# Altium schematic sheet rs485.SchDoc: Test
size A4; DrawnBy: Łukasz Przeniosło; Organization: Zachodniopomorski; Address1: Uniwersytet Technologiczny; Address2: w Szczecinie; Address3: Wydział Elektryczny; DocumentNumber: 6; Revision: 1.0; SheetNumber: 6; SheetTotal: 8
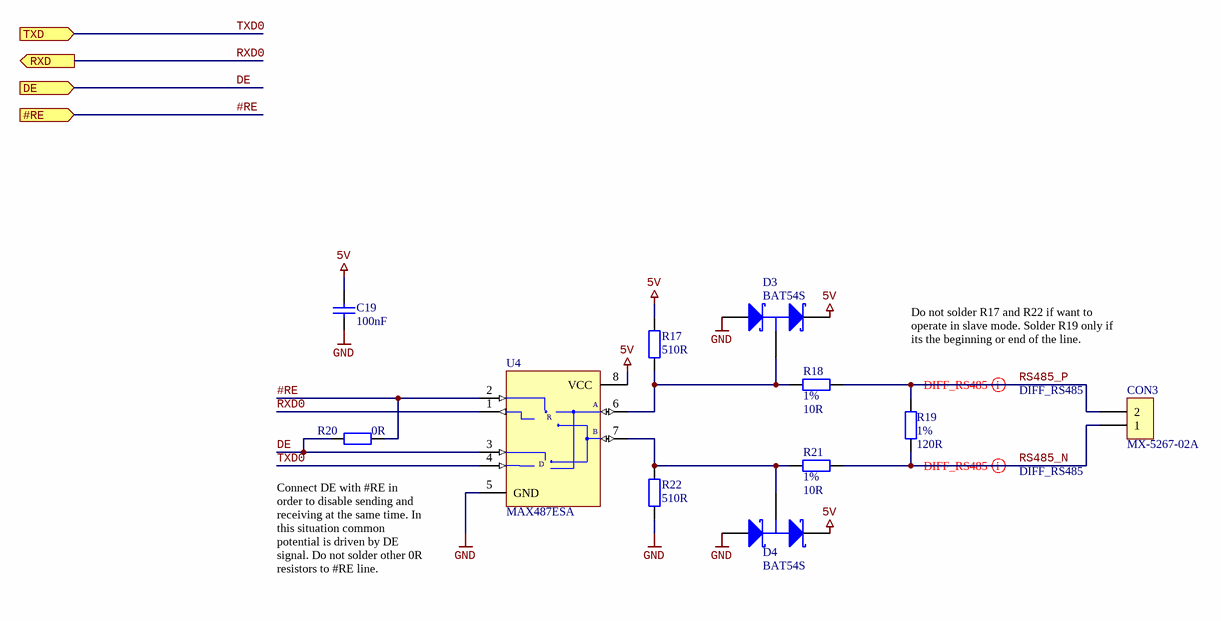
[diagram p0: rs485.SchDoc]

## Parts
C19  100nF  [CAPC1608N]
CON3  MX-5267-02A  [MX-5267-02A]
D3  BAT54S  [SOT23-3L]
D4  BAT54S  [SOT23-3L]
R17  510R  [RESC1608N]
R18  Tolerance: 1%  [RESC2012N]  (hidden comment: 10R)
R19  Tolerance: 1%  [RESC3216N]  (hidden comment: 120R)
R20  0R  [RESC1005N]
R21  Tolerance: 1%  [RESC2012N]  (hidden comment: 10R)
R22  510R  [RESC1608N]
U4  MAX487ESA  [SO-8_L]

## Ports
#RE (in), DE (in), RXD (out), TXD (in)

## Nets
5V: C19.1 D3.2(K) D4.2(K) R17.2 U4.8(VCC)
GND: C19.2 D3.1(A) D4.1(A) R22.1 U4.5(GND)
#RE: R20.2 U4.2(~{RE}) ; port #RE
DE: R20.1 U4.3(DE) ; port DE
RS485_N: CON3.1 R19.2 R21.1
RS485_P: CON3.2 R18.1 R19.1
RXD0: U4.1(RO) ; port RXD
TXD0: U4.4(DI) ; port TXD
NetD3_3: D3.3(C) R17.1 R18.2 U4.6(A)
NetD4_3: D4.3(C) R21.2 R22.2 U4.7(B)

## Layout directives
differential pair; net class DIFF_RS485: RS485_N, RS485_P

## Notes on the sheet
- Do not solder R17 and R22 if want to operate in slave mode. Solder R19 only if its the beginning or end of the line.
- (near R20) Connect DE with #RE in order to disable sending and receiving at the same time. In this situation common potential is driven by DE signal. Do not solder other 0R resistors to #RE line.
- Title
- Size:
- Date:
- A4
- Author:
- Time:
- Sheet
- of
- File:
- (in symbol MAX487ESA) R; D

## Library data of the parts
C19 = Capacitor: Value: 100nF
CON3 = MX-02227-2021: Pith 2.54mm, 2-pin; ComponentLink1Description: Manufacturer Link; ComponentLink2Description: Datasheet; Distributor: tme.pl; tme.pl: MX-6410-03A
D3 D4 = BAT54S: Schottky Barrier Double Diode; Published: 17-Sep-2003; DatasheetVersion: 4-Mar-2002; PackageVersion: May-1999; PackageReference: SOT23; Publisher: Altium Limited; PackageDescription: 3-Pin SOT-23 Package 0.95 mm Pitch, 2.3 mm Lead Span; ComponentLink1Description: Manufacturer Link; ComponentLink1URL: http://www.semiconductors.philips.com/; ComponentLink2Description: Datasheet; ComponentLink2URL: http://www.semiconductors.philips.com/acrobat/datasheets/BAT54_SERIES_4.pdf; LatestRevisionDate: 12-Dec-2006; LatestRevisionNote: IPC-7351 Footprint Added.
R17 R22 = Resistor: Tolerance: 5%; Power: 0W; Value: 510R
R18 R19 R21 = Resistor: Power: 0W
  R18 R21: Value: 10R
  R19: Value: 120R
R20 = Resistor: Power: 0W; Tolerance: 1%; Value: 0R
U4 = MAX487ESA: Low-Power, Slew-Rate-Limited RS-485/RS-422 Transceiver; Published: 16-Jan-2001; LatestRevisionDate: 13-Apr-2006; LatestRevisionNote: IPC-7351 Footprint Added.; DatasheetVersion: Feb-1996; PackageReference: NSO8; Publisher: Altium Limited; PackageDescription: 8-Pin Small Outline Integrated Circuit 1.27 mm Pitch; Code_JEDEC: MS-012-AA; Code_IPC: SOIC127P600-8; ComponentLink1Description: Manufacturer Link; ComponentLink1URL: http://www.maxim-ic.com/; ComponentLink2Description: Datasheet; ComponentLink2URL: http://pdfserv.maxim-ic.com/en/ds/MAX1487-MAX491.pdf